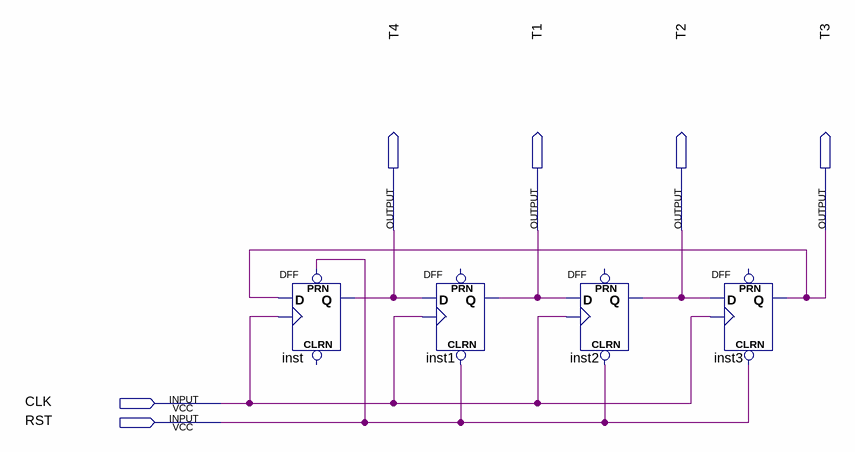
[diagram p0: schematic sheet]
// Quartus schematic Beat_Generator.bdf as structural Verilog: 4 symbols, 6 pins
module Beat_Generator (
  input  CLK,
  input  RST,
  output T4,
  output T1,
  output T2,
  output T3
);

  DFF inst (.CLK(CLK), .D(T3), .PRN(RST), .Q(T4));  // open: CLRN
  DFF inst1 (.CLRN(RST), .CLK(CLK), .D(T4), .Q(T1));  // open: PRN
  DFF inst2 (.CLRN(RST), .CLK(CLK), .D(T1), .Q(T2));  // open: PRN
  DFF inst3 (.CLRN(RST), .CLK(CLK), .D(T2), .Q(T3));  // open: PRN
endmodule
